# Altium schematic sheet CounterMS.SchDoc
size A4; SheetNumber: 3; SheetTotal: 12
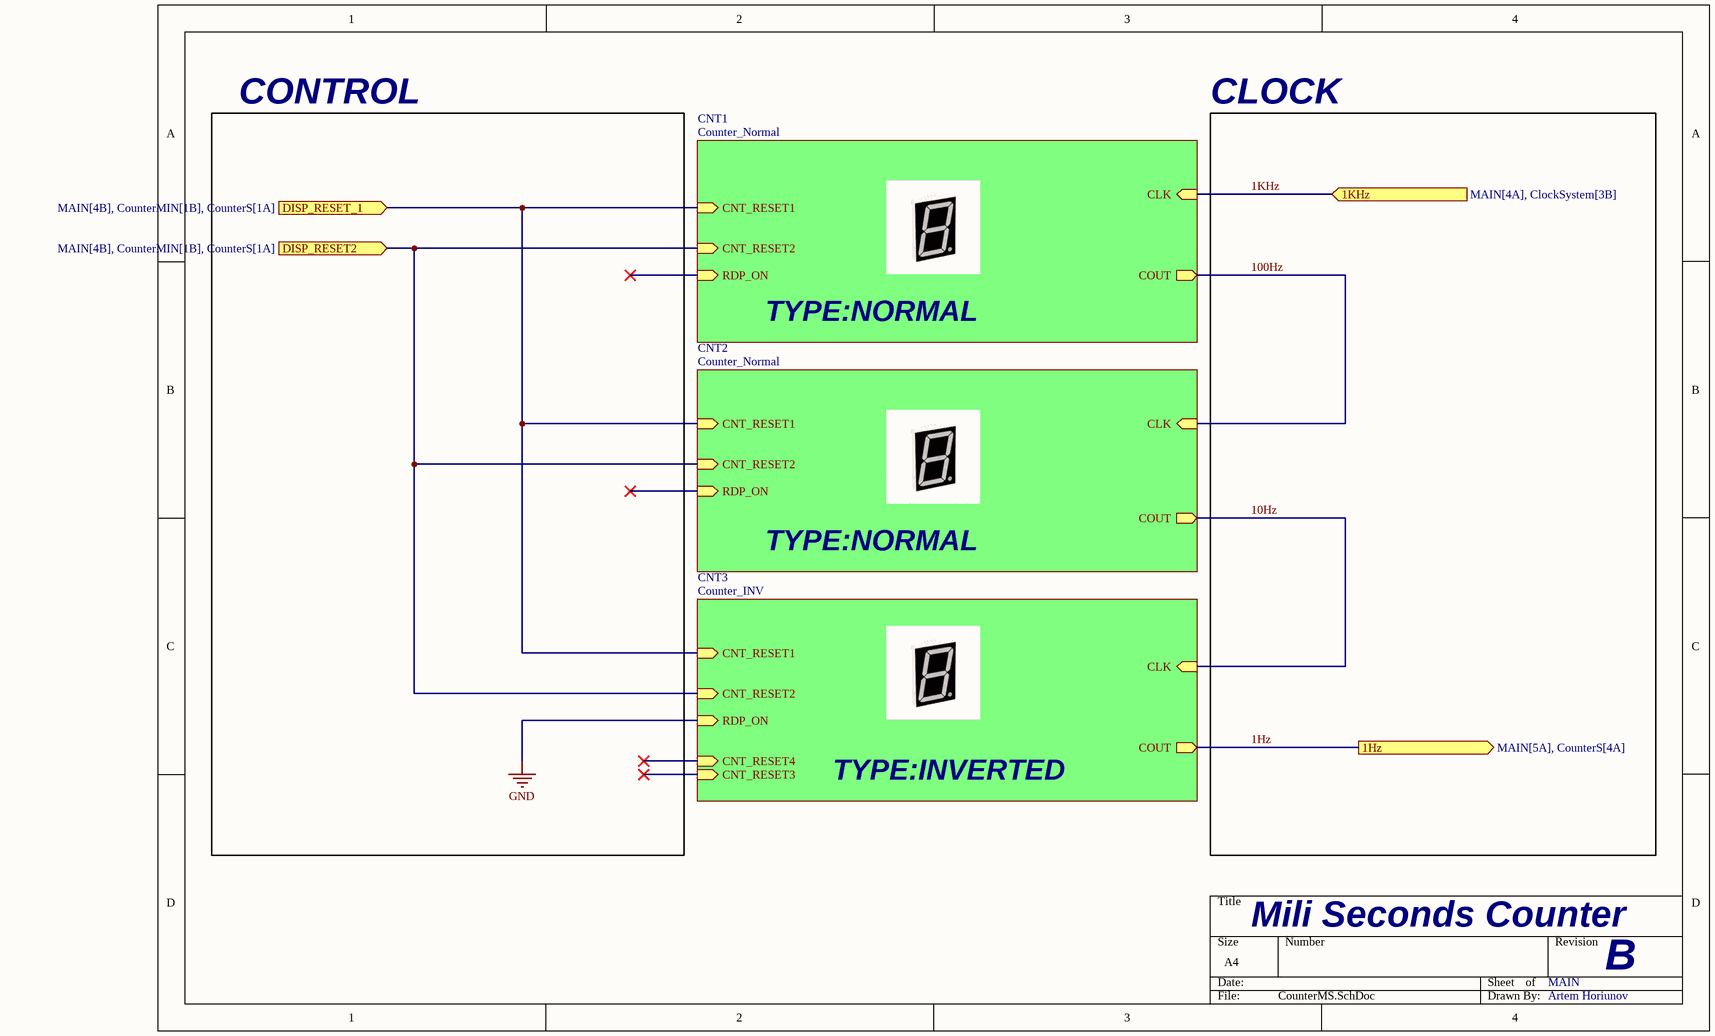
[diagram p0: CounterMS.SchDoc]

## Sub-sheets
CNT1 = Counter_Normal: COUT (out), CNT_RESET1 (in), CNT_RESET2 (in), CLK (in), RDP_ON (in)
CNT2 = Counter_Normal: COUT (out), CNT_RESET1 (in), CNT_RESET2 (in), CLK (in), RDP_ON (in)
CNT3 = Counter_INV: COUT (out), CNT_RESET1 (in), CNT_RESET2 (in), CLK (in), RDP_ON (in), CNT_RESET4 (in), CNT_RESET3 (in)

## Ports
1Hz (out, see MAIN[5A], CounterS[4A]), 1KHz (in, see MAIN[4A], ClockSystem[3B]), DISP_RESET2 (in, see MAIN[4B], CounterMIN[1B], CounterS[1A]), DISP_RESET_1 (in, see MAIN[4B], CounterMIN[1B], CounterS[1A])

## Nets
GND: sheet CNT3/RDP_ON
1Hz: port 1Hz, sheet CNT3/COUT
1KHz: port 1KHz, sheet CNT1/CLK
10Hz: sheet CNT2/COUT, sheet CNT3/CLK
100Hz: sheet CNT1/COUT, sheet CNT2/CLK
DISP_RESET2: port DISP_RESET2, sheet CNT1/CNT_RESET2, sheet CNT2/CNT_RESET2, sheet CNT3/CNT_RESET2
DISP_RESET_1: port DISP_RESET_1, sheet CNT1/CNT_RESET1, sheet CNT2/CNT_RESET1, sheet CNT3/CNT_RESET1

## Notes on the sheet
- CONTROL
- CLOCK
- TYPE:NORMAL
- TYPE:INVERTED
- Mili Seconds Counter
- MAIN
- B
- Artem Horiunov